# Altium schematic sheet 12-DSP PROCESSOR 2-OF-3.SchDoc
size 513 x 386 mm
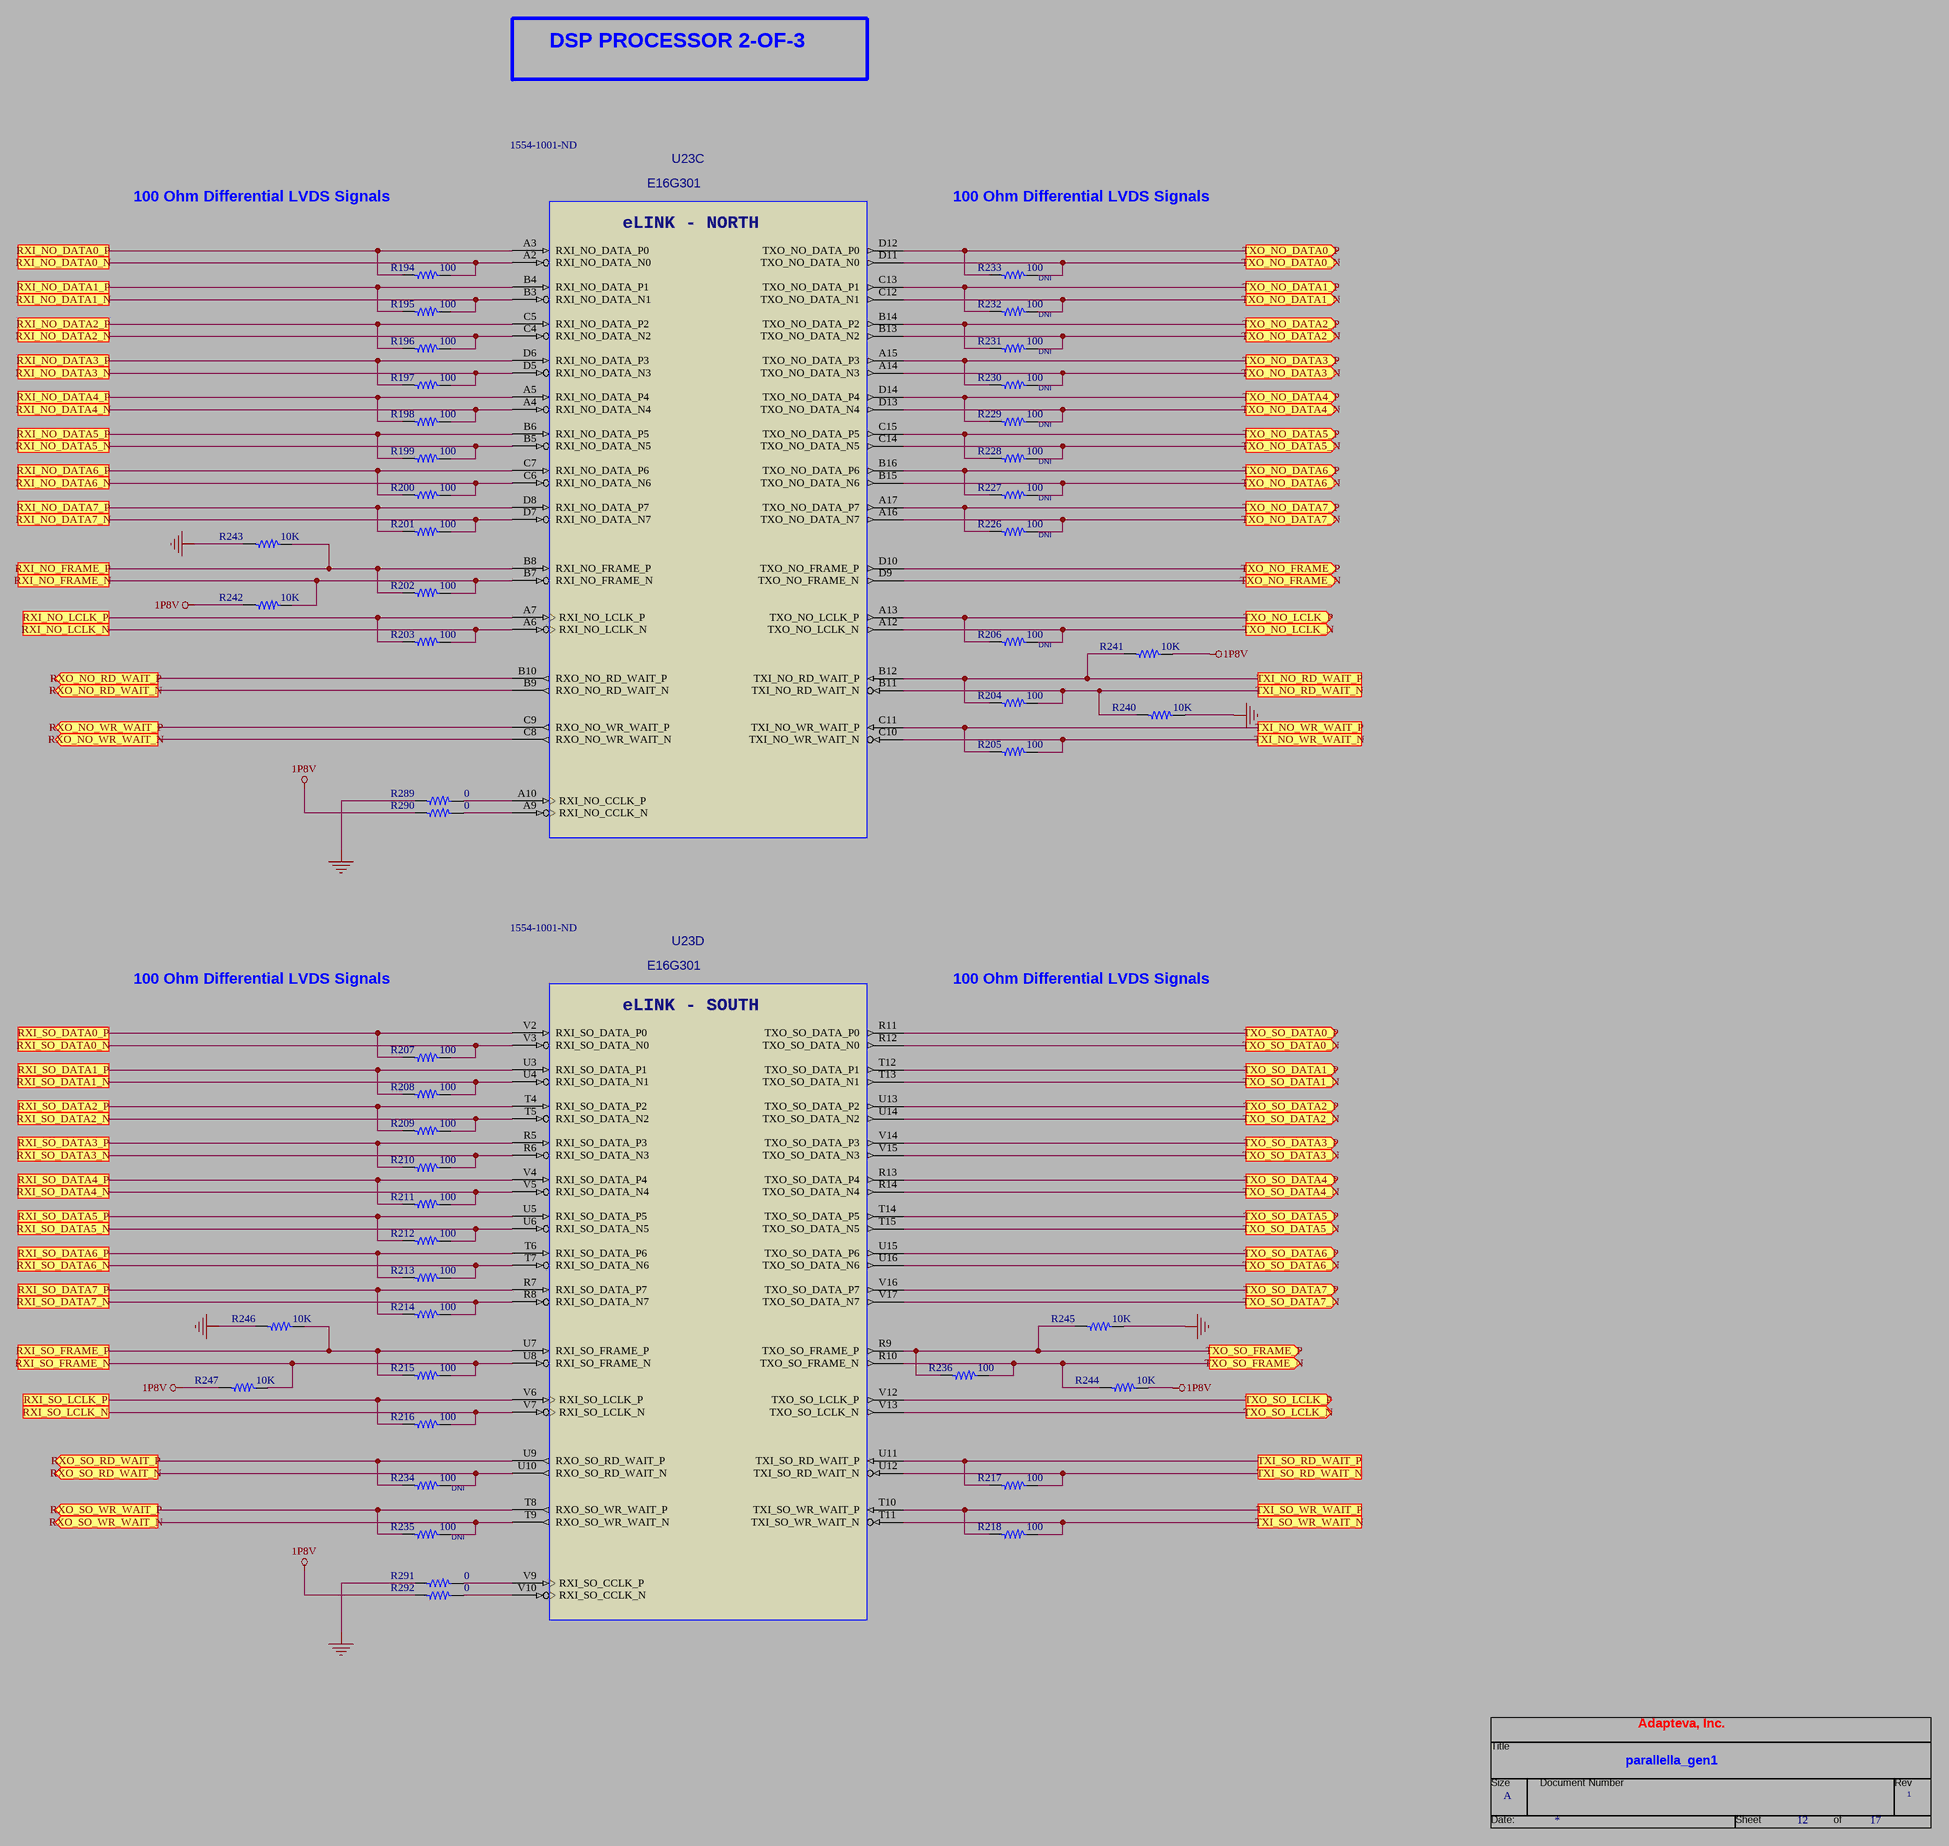
[diagram p0: 12-DSP PROCESSOR 2-OF-3.SchDoc]

## Parts
*  RevCode: 1  Title: parallella_gen1  Page Size: A  Page Number: 12  Page Count: 17  OrgAddr1: Adapteva, Inc.  (hidden comment: TitleBlock0)  (graphical)
R194  100  [R0402]
R195  100  [R0402]
R196  100  [R0402]
R197  100  [R0402]
R198  100  [R0402]
R199  100  [R0402]
R200  100  [R0402]
R201  100  [R0402]
R202  100  [R0402]
R203  100  [R0402]
R204  100  [R0402]
R205  100  [R0402]
R206  100  INSTALL: DNI  [R0402]
R207  100  [R0402]
R208  100  [R0402]
R209  100  [R0402]
R210  100  [R0402]
R211  100  [R0402]
R212  100  [R0402]
R213  100  [R0402]
R214  100  [R0402]
R215  100  [R0402]
R216  100  [R0402]
R217  100  [R0402]
R218  100  [R0402]
R226  100  INSTALL: DNI  [R0402]
R227  100  INSTALL: DNI  [R0402]
R228  100  INSTALL: DNI  [R0402]
R229  100  INSTALL: DNI  [R0402]
R230  100  INSTALL: DNI  [R0402]
R231  100  INSTALL: DNI  [R0402]
R232  100  INSTALL: DNI  [R0402]
R233  100  INSTALL: DNI  [R0402]
R234  100  INSTALL: DNI  [R0402]
R235  100  INSTALL: DNI  [R0402]
R236  100  [R0402]
R240  10K  [R0402]
R241  10K  [R0402]
R242  10K  [R0402]
R243  10K  [R0402]
R244  10K  [R0402]
R245  10K  [R0402]
R246  10K  [R0402]
R247  10K  [R0402]
R289  0  [R0402]
R290  0  [R0402]
R291  0  [R0402]
R292  0  [R0402]
U23  Vendor PN: E16G301  Supplier Part Number 1: 1554-1001-ND  [BGA324_15SQX1P5_P8MMP]  (hidden comment: 16-CORE MICROPROCESSOR)  (parts C,D of 6)

## Ports
RXI_NO_DATA0_N, RXI_NO_DATA0_P, RXI_NO_DATA1_N, RXI_NO_DATA1_P, RXI_NO_DATA2_N, RXI_NO_DATA2_P, RXI_NO_DATA3_N, RXI_NO_DATA3_P, RXI_NO_DATA4_N, RXI_NO_DATA4_P, RXI_NO_DATA5_N, RXI_NO_DATA5_P, RXI_NO_DATA6_N, RXI_NO_DATA6_P, RXI_NO_DATA7_N, RXI_NO_DATA7_P, RXI_NO_FRAME_N, RXI_NO_FRAME_P, RXI_NO_LCLK_N, RXI_NO_LCLK_P, RXI_SO_DATA0_N, RXI_SO_DATA0_P, RXI_SO_DATA1_N, RXI_SO_DATA1_P, RXI_SO_DATA2_N, RXI_SO_DATA2_P, RXI_SO_DATA3_N, RXI_SO_DATA3_P, RXI_SO_DATA4_N, RXI_SO_DATA4_P, RXI_SO_DATA5_N, RXI_SO_DATA5_P, RXI_SO_DATA6_N, RXI_SO_DATA6_P, RXI_SO_DATA7_N, RXI_SO_DATA7_P, RXI_SO_FRAME_N, RXI_SO_FRAME_P, RXI_SO_LCLK_N, RXI_SO_LCLK_P, RXO_NO_RD_WAIT_N (out), RXO_NO_RD_WAIT_P (out), RXO_NO_WR_WAIT_N (out), RXO_NO_WR_WAIT_P (out), RXO_SO_RD_WAIT_N (out), RXO_SO_RD_WAIT_P (out), RXO_SO_WR_WAIT_N (out), RXO_SO_WR_WAIT_P (out), TXI_NO_RD_WAIT_N, TXI_NO_RD_WAIT_P, TXI_NO_WR_WAIT_N, TXI_NO_WR_WAIT_P, TXI_SO_RD_WAIT_N, TXI_SO_RD_WAIT_P, TXI_SO_WR_WAIT_N, TXI_SO_WR_WAIT_P, TXO_NO_DATA0_N (out), TXO_NO_DATA0_P (out), TXO_NO_DATA1_N (out), TXO_NO_DATA1_P (out), TXO_NO_DATA2_N (out), TXO_NO_DATA2_P (out), TXO_NO_DATA3_N (out), TXO_NO_DATA3_P (out), TXO_NO_DATA4_N (out), TXO_NO_DATA4_P (out), TXO_NO_DATA5_N (out), TXO_NO_DATA5_P (out), TXO_NO_DATA6_N (out), TXO_NO_DATA6_P (out), TXO_NO_DATA7_N (out), TXO_NO_DATA7_P (out), TXO_NO_FRAME_N (out), TXO_NO_FRAME_P (out), TXO_NO_LCLK_N (out), TXO_NO_LCLK_P (out), TXO_SO_DATA0_N (out), TXO_SO_DATA0_P (out), TXO_SO_DATA1_N (out), TXO_SO_DATA1_P (out), TXO_SO_DATA2_N (out), TXO_SO_DATA2_P (out), TXO_SO_DATA3_N (out), TXO_SO_DATA3_P (out), TXO_SO_DATA4_N (out), TXO_SO_DATA4_P (out), TXO_SO_DATA5_N (out), TXO_SO_DATA5_P (out), TXO_SO_DATA6_N (out), TXO_SO_DATA6_P (out), TXO_SO_DATA7_N (out), TXO_SO_DATA7_P (out), TXO_SO_FRAME_N (out), TXO_SO_FRAME_P (out), TXO_SO_LCLK_N (out), TXO_SO_LCLK_P (out)

## Nets
1P8V: R241.2 R242.1 R244.2 R247.1 R290.1 R292.1
GND: R240.2 R243.1 R245.2 R246.1 R289.1 R291.1
RXI_NO_DATA0_N: R194.2 U23.A2(RXI_NO_DATA_N0) ; port RXI_NO_DATA0_N
RXI_NO_DATA0_P: R194.1 U23.A3(RXI_NO_DATA_P0) ; port RXI_NO_DATA0_P
RXI_NO_DATA1_N: R195.2 U23.B3(RXI_NO_DATA_N1) ; port RXI_NO_DATA1_N
RXI_NO_DATA1_P: R195.1 U23.B4(RXI_NO_DATA_P1) ; port RXI_NO_DATA1_P
RXI_NO_DATA2_N: R196.2 U23.C4(RXI_NO_DATA_N2) ; port RXI_NO_DATA2_N
RXI_NO_DATA2_P: R196.1 U23.C5(RXI_NO_DATA_P2) ; port RXI_NO_DATA2_P
RXI_NO_DATA3_N: R197.2 U23.D5(RXI_NO_DATA_N3) ; port RXI_NO_DATA3_N
RXI_NO_DATA3_P: R197.1 U23.D6(RXI_NO_DATA_P3) ; port RXI_NO_DATA3_P
RXI_NO_DATA4_N: R198.2 U23.A4(RXI_NO_DATA_N4) ; port RXI_NO_DATA4_N
RXI_NO_DATA4_P: R198.1 U23.A5(RXI_NO_DATA_P4) ; port RXI_NO_DATA4_P
RXI_NO_DATA5_N: R199.2 U23.B5(RXI_NO_DATA_N5) ; port RXI_NO_DATA5_N
RXI_NO_DATA5_P: R199.1 U23.B6(RXI_NO_DATA_P5) ; port RXI_NO_DATA5_P
RXI_NO_DATA6_N: R200.2 U23.C6(RXI_NO_DATA_N6) ; port RXI_NO_DATA6_N
RXI_NO_DATA6_P: R200.1 U23.C7(RXI_NO_DATA_P6) ; port RXI_NO_DATA6_P
RXI_NO_DATA7_N: R201.2 U23.D7(RXI_NO_DATA_N7) ; port RXI_NO_DATA7_N
RXI_NO_DATA7_P: R201.1 U23.D8(RXI_NO_DATA_P7) ; port RXI_NO_DATA7_P
RXI_NO_FRAME_N: R202.2 R242.2 U23.B7(RXI_NO_FRAME_N) ; port RXI_NO_FRAME_N
RXI_NO_FRAME_P: R202.1 R243.2 U23.B8(RXI_NO_FRAME_P) ; port RXI_NO_FRAME_P
RXI_NO_LCLK_N: R203.2 U23.A6(RXI_NO_LCLK_N) ; port RXI_NO_LCLK_N
RXI_NO_LCLK_P: R203.1 U23.A7(RXI_NO_LCLK_P) ; port RXI_NO_LCLK_P
RXI_SO_DATA0_N: R207.2 U23.V3(RXI_SO_DATA_N0) ; port RXI_SO_DATA0_N
RXI_SO_DATA0_P: R207.1 U23.V2(RXI_SO_DATA_P0) ; port RXI_SO_DATA0_P
RXI_SO_DATA1_N: R208.2 U23.U4(RXI_SO_DATA_N1) ; port RXI_SO_DATA1_N
RXI_SO_DATA1_P: R208.1 U23.U3(RXI_SO_DATA_P1) ; port RXI_SO_DATA1_P
RXI_SO_DATA2_N: R209.2 U23.T5(RXI_SO_DATA_N2) ; port RXI_SO_DATA2_N
RXI_SO_DATA2_P: R209.1 U23.T4(RXI_SO_DATA_P2) ; port RXI_SO_DATA2_P
RXI_SO_DATA3_N: R210.2 U23.R6(RXI_SO_DATA_N3) ; port RXI_SO_DATA3_N
RXI_SO_DATA3_P: R210.1 U23.R5(RXI_SO_DATA_P3) ; port RXI_SO_DATA3_P
RXI_SO_DATA4_N: R211.2 U23.V5(RXI_SO_DATA_N4) ; port RXI_SO_DATA4_N
RXI_SO_DATA4_P: R211.1 U23.V4(RXI_SO_DATA_P4) ; port RXI_SO_DATA4_P
RXI_SO_DATA5_N: R212.2 U23.U6(RXI_SO_DATA_N5) ; port RXI_SO_DATA5_N
RXI_SO_DATA5_P: R212.1 U23.U5(RXI_SO_DATA_P5) ; port RXI_SO_DATA5_P
RXI_SO_DATA6_N: R213.2 U23.T7(RXI_SO_DATA_N6) ; port RXI_SO_DATA6_N
RXI_SO_DATA6_P: R213.1 U23.T6(RXI_SO_DATA_P6) ; port RXI_SO_DATA6_P
RXI_SO_DATA7_N: R214.2 U23.R8(RXI_SO_DATA_N7) ; port RXI_SO_DATA7_N
RXI_SO_DATA7_P: R214.1 U23.R7(RXI_SO_DATA_P7) ; port RXI_SO_DATA7_P
RXI_SO_FRAME_N: R215.2 R247.2 U23.U8(RXI_SO_FRAME_N) ; port RXI_SO_FRAME_N
RXI_SO_FRAME_P: R215.1 R246.2 U23.U7(RXI_SO_FRAME_P) ; port RXI_SO_FRAME_P
RXI_SO_LCLK_N: R216.2 U23.V7(RXI_SO_LCLK_N) ; port RXI_SO_LCLK_N
RXI_SO_LCLK_P: R216.1 U23.V6(RXI_SO_LCLK_P) ; port RXI_SO_LCLK_P
RXO_NO_RD_WAIT_N: U23.B9(RXO_NO_RD_WAIT_N) ; port RXO_NO_RD_WAIT_N
RXO_NO_RD_WAIT_P: U23.B10(RXO_NO_RD_WAIT_P) ; port RXO_NO_RD_WAIT_P
RXO_NO_WR_WAIT_N: U23.C8(RXO_NO_WR_WAIT_N) ; port RXO_NO_WR_WAIT_N
RXO_NO_WR_WAIT_P: U23.C9(RXO_NO_WR_WAIT_P) ; port RXO_NO_WR_WAIT_P
RXO_SO_RD_WAIT_N: R234.2 U23.U10(RXO_SO_RD_WAIT_N) ; port RXO_SO_RD_WAIT_N
RXO_SO_RD_WAIT_P: R234.1 U23.U9(RXO_SO_RD_WAIT_P) ; port RXO_SO_RD_WAIT_P
RXO_SO_WR_WAIT_N: R235.2 U23.T9(RXO_SO_WR_WAIT_N) ; port RXO_SO_WR_WAIT_N
RXO_SO_WR_WAIT_P: R235.1 U23.T8(RXO_SO_WR_WAIT_P) ; port RXO_SO_WR_WAIT_P
TXI_NO_RD_WAIT_N: R204.2 R240.1 U23.B11(TXI_NO_RD_WAIT_N) ; port TXI_NO_RD_WAIT_N
TXI_NO_RD_WAIT_P: R204.1 R241.1 U23.B12(TXI_NO_RD_WAIT_P) ; port TXI_NO_RD_WAIT_P
TXI_NO_WR_WAIT_N: R205.2 U23.C10(TXI_NO_WR_WAIT_N) ; port TXI_NO_WR_WAIT_N
TXI_NO_WR_WAIT_P: R205.1 U23.C11(TXI_NO_WR_WAIT_P) ; port TXI_NO_WR_WAIT_P
TXI_SO_RD_WAIT_N: R217.2 U23.U12(TXI_SO_RD_WAIT_N) ; port TXI_SO_RD_WAIT_N
TXI_SO_RD_WAIT_P: R217.1 U23.U11(TXI_SO_RD_WAIT_P) ; port TXI_SO_RD_WAIT_P
TXI_SO_WR_WAIT_N: R218.2 U23.T11(TXI_SO_WR_WAIT_N) ; port TXI_SO_WR_WAIT_N
TXI_SO_WR_WAIT_P: R218.1 U23.T10(TXI_SO_WR_WAIT_P) ; port TXI_SO_WR_WAIT_P
TXO_NO_DATA0_N: R233.2 U23.D11(TXO_NO_DATA_N0) ; port TXO_NO_DATA0_N
TXO_NO_DATA0_P: R233.1 U23.D12(TXO_NO_DATA_P0) ; port TXO_NO_DATA0_P
TXO_NO_DATA1_N: R232.2 U23.C12(TXO_NO_DATA_N1) ; port TXO_NO_DATA1_N
TXO_NO_DATA1_P: R232.1 U23.C13(TXO_NO_DATA_P1) ; port TXO_NO_DATA1_P
TXO_NO_DATA2_N: R231.2 U23.B13(TXO_NO_DATA_N2) ; port TXO_NO_DATA2_N
TXO_NO_DATA2_P: R231.1 U23.B14(TXO_NO_DATA_P2) ; port TXO_NO_DATA2_P
TXO_NO_DATA3_N: R230.2 U23.A14(TXO_NO_DATA_N3) ; port TXO_NO_DATA3_N
TXO_NO_DATA3_P: R230.1 U23.A15(TXO_NO_DATA_P3) ; port TXO_NO_DATA3_P
TXO_NO_DATA4_N: R229.2 U23.D13(TXO_NO_DATA_N4) ; port TXO_NO_DATA4_N
TXO_NO_DATA4_P: R229.1 U23.D14(TXO_NO_DATA_P4) ; port TXO_NO_DATA4_P
TXO_NO_DATA5_N: R228.2 U23.C14(TXO_NO_DATA_N5) ; port TXO_NO_DATA5_N
TXO_NO_DATA5_P: R228.1 U23.C15(TXO_NO_DATA_P5) ; port TXO_NO_DATA5_P
TXO_NO_DATA6_N: R227.2 U23.B15(TXO_NO_DATA_N6) ; port TXO_NO_DATA6_N
TXO_NO_DATA6_P: R227.1 U23.B16(TXO_NO_DATA_P6) ; port TXO_NO_DATA6_P
TXO_NO_DATA7_N: R226.2 U23.A16(TXO_NO_DATA_N7) ; port TXO_NO_DATA7_N
TXO_NO_DATA7_P: R226.1 U23.A17(TXO_NO_DATA_P7) ; port TXO_NO_DATA7_P
TXO_NO_FRAME_N: U23.D9(TXO_NO_FRAME_N) ; port TXO_NO_FRAME_N
TXO_NO_FRAME_P: U23.D10(TXO_NO_FRAME_P) ; port TXO_NO_FRAME_P
TXO_NO_LCLK_N: R206.2 U23.A12(TXO_NO_LCLK_N) ; port TXO_NO_LCLK_N
TXO_NO_LCLK_P: R206.1 U23.A13(TXO_NO_LCLK_P) ; port TXO_NO_LCLK_P
TXO_SO_DATA0_N: U23.R12(TXO_SO_DATA_N0) ; port TXO_SO_DATA0_N
TXO_SO_DATA0_P: U23.R11(TXO_SO_DATA_P0) ; port TXO_SO_DATA0_P
TXO_SO_DATA1_N: U23.T13(TXO_SO_DATA_N1) ; port TXO_SO_DATA1_N
TXO_SO_DATA1_P: U23.T12(TXO_SO_DATA_P1) ; port TXO_SO_DATA1_P
TXO_SO_DATA2_N: U23.U14(TXO_SO_DATA_N2) ; port TXO_SO_DATA2_N
TXO_SO_DATA2_P: U23.U13(TXO_SO_DATA_P2) ; port TXO_SO_DATA2_P
TXO_SO_DATA3_N: U23.V15(TXO_SO_DATA_N3) ; port TXO_SO_DATA3_N
TXO_SO_DATA3_P: U23.V14(TXO_SO_DATA_P3) ; port TXO_SO_DATA3_P
TXO_SO_DATA4_N: U23.R14(TXO_SO_DATA_N4) ; port TXO_SO_DATA4_N
TXO_SO_DATA4_P: U23.R13(TXO_SO_DATA_P4) ; port TXO_SO_DATA4_P
TXO_SO_DATA5_N: U23.T15(TXO_SO_DATA_N5) ; port TXO_SO_DATA5_N
TXO_SO_DATA5_P: U23.T14(TXO_SO_DATA_P5) ; port TXO_SO_DATA5_P
TXO_SO_DATA6_N: U23.U16(TXO_SO_DATA_N6) ; port TXO_SO_DATA6_N
TXO_SO_DATA6_P: U23.U15(TXO_SO_DATA_P6) ; port TXO_SO_DATA6_P
TXO_SO_DATA7_N: U23.V17(TXO_SO_DATA_N7) ; port TXO_SO_DATA7_N
TXO_SO_DATA7_P: U23.V16(TXO_SO_DATA_P7) ; port TXO_SO_DATA7_P
TXO_SO_FRAME_N: R236.2 R244.1 U23.R10(TXO_SO_FRAME_N) ; port TXO_SO_FRAME_N
TXO_SO_FRAME_P: R236.1 R245.1 U23.R9(TXO_SO_FRAME_P) ; port TXO_SO_FRAME_P
TXO_SO_LCLK_N: U23.V13(TXO_SO_LCLK_N) ; port TXO_SO_LCLK_N
TXO_SO_LCLK_P: U23.V12(TXO_SO_LCLK_P) ; port TXO_SO_LCLK_P
NetR289_2: R289.2 U23.A10(RXI_NO_CCLK_P)
NetR290_2: R290.2 U23.A9(RXI_NO_CCLK_N)
NetR291_2: R291.2 U23.V9(RXI_SO_CCLK_P)
NetR292_2: R292.2 U23.V10(RXI_SO_CCLK_N)

## Notes on the sheet
- DSP PROCESSOR 2-OF-3
- 100 Ohm Differential LVDS Signals
- (in symbol EPIPHANY_E16G301, part C) eLINK - NORTH
- (in symbol EPIPHANY_E16G301, part D) eLINK - SOUTH
- (in symbol TitleBlock0) Title; Size; Document Number; Rev; Date:; Sheet; of

## Library data of the parts
R194-R218 R226-R236 = RES0402_100: RES, 0402, 100, 1%; ALT_SYMBOLS: R0402_BGA; Vendor PN: CRCW0402100RFKED; Vendor: VISHAY/DALE; MFG: VISHAY; MFG PART NO: CRCW0402100RFKED; DEVICE: RES0402_100; PCB Footprint: R0402
R240-R247 = RES0402_10K: RES, 0402, 10K; MFG PART NO: CRCW040210K0FKED; ALT_SYMBOLS: R0402_BGA; MFG: VISHAY; Vendor: VISHAY/DALE; DEVICE: RES0402_10K; Vendor PN: CRCW040210K0FKED; PCB Footprint: R0402
R289-R292 = RES0402_0: RES, 0402, 0 OHM, 1%; MFG PART NO: CRCW04020000Z0ED; ALT_SYMBOLS: R0402_BGA; MFG: VISHAY; Vendor: VISHAY/DALE; DEVICE: RES0402_0; Vendor PN: CRCW04020000Z0ED; PCB Footprint: R0402
U23 = EPIPHANY_E16G301: IC, 16-CORE MICROPROCESSOR, ADAPTEVA, E16G301, BGA324; SPLIT_INST: TRUE; Vendor: ADAPTEVA; DEVICE: EPIPHANY_E16G301; PCB Footprint: BGA324_15SQX1P5_P8MMP; Supplier 1: Digi-Key
* = TitleBlock0: Page Create Date: March  8, 1995; Page Modify Date: *